# EAGLE design ottawa-badge-mini-r1-staff (EAGLE 5.12)
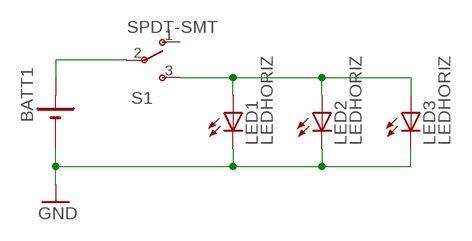
[diagram p0: schematic, sheet 1]

## Parts
BATT1  2032SMD  [2032SMD]
LED1  LEDHORIZ  [5MMLED-HORIZ]
LED2  LEDHORIZ  [5MMLED-HORIZ]
LED3  LEDHORIZ  [5MMLED-HORIZ]
S1  SPDT-SMT  [SPDT-SMT]

## Nets
GND: BATT1.- LED1.K(C) LED2.K(C) LED3.K(C)
N$1: BATT1.+ S1.2(P)
N$2: LED1.A LED2.A LED3.A S1.3(S)
Unconnected: S1.1(O)

## Library data of the parts
BATT1 = rbg-4ucon-battery:2032SMD
LED1-LED3 = artwork:LED
S1 = smt-spdt-aliexpress:SPDT-SMT

## Board
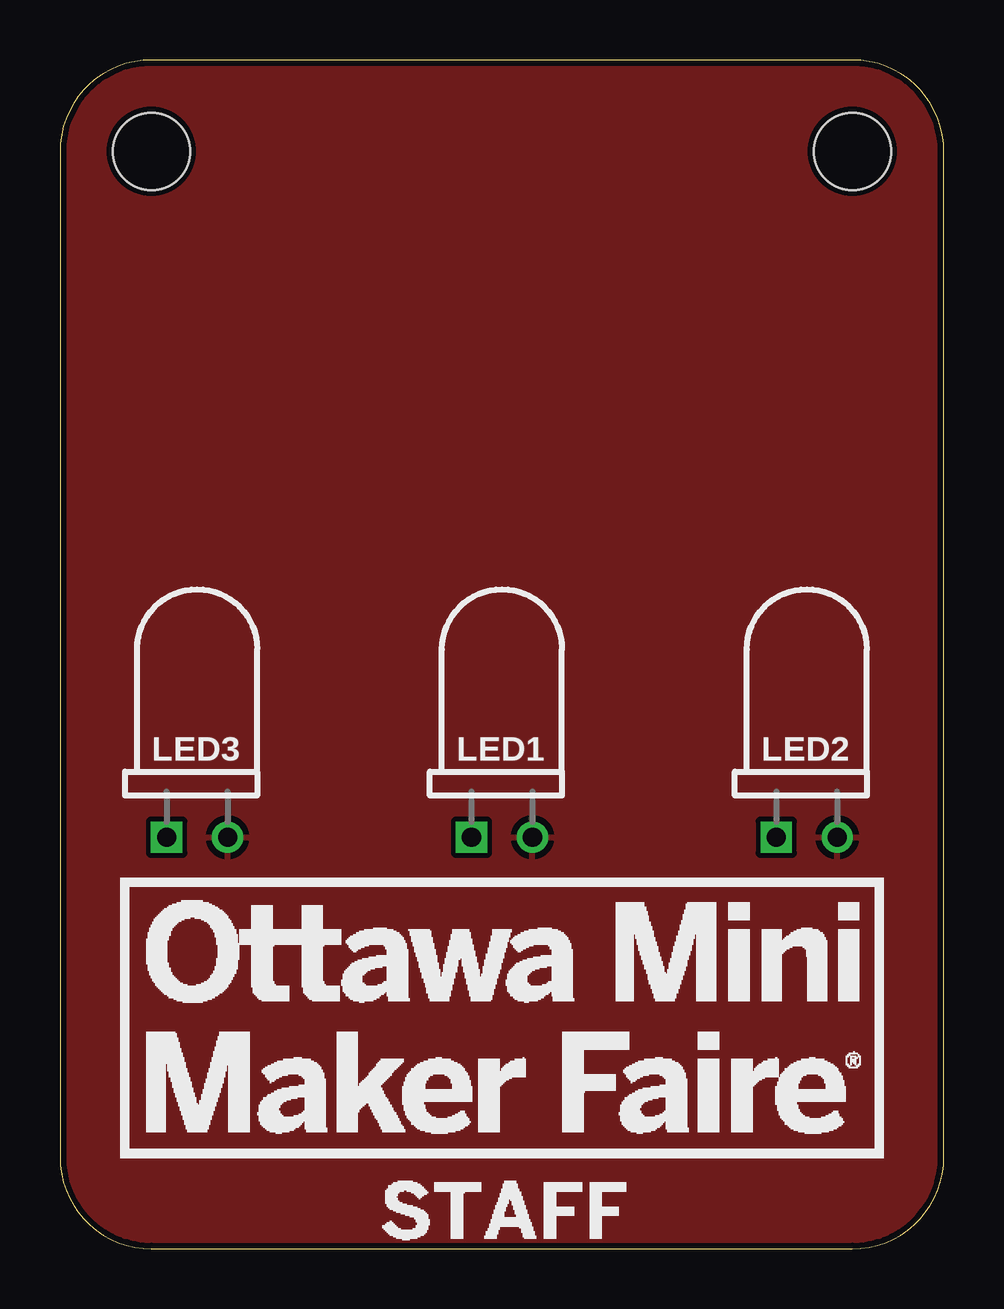
[diagram p1: board, top side]
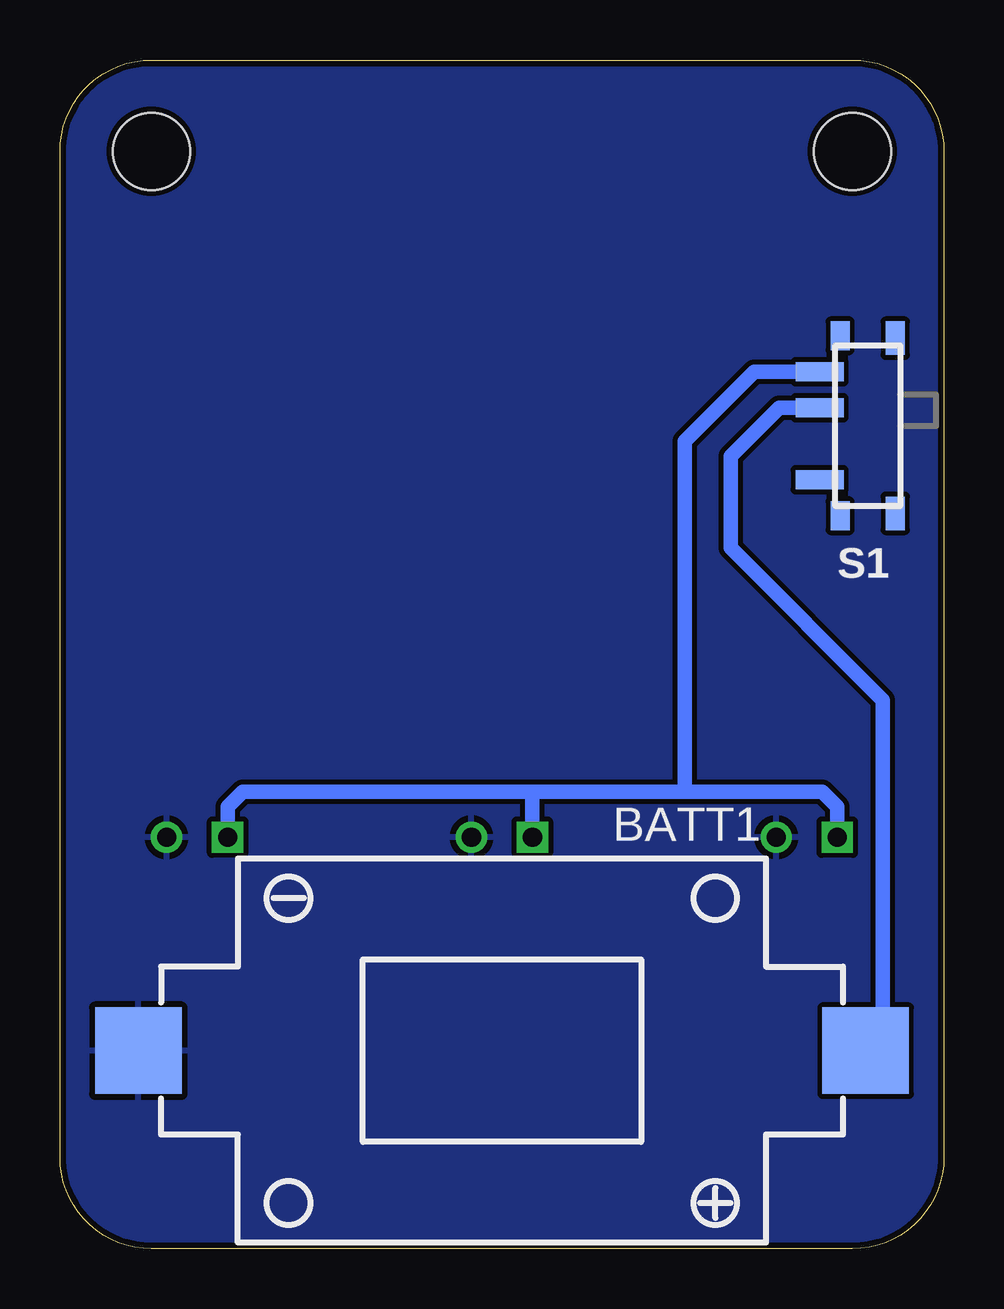
[diagram p2: board, bottom side, seen from below]

Size 36.83 x 49.53 mm. Coordinates in mm from the lower left corner, seen from the top.
Outline: 33.02,0 arc90 36.83,3.81 36.83,45.72 arc90 33.02,49.53 3.81,49.53 arc90 0,45.72 0,3.81 arc90 3.81,0 33.02,0
Copper layers (1*16): Top 0.035mm / dielectric 1.5mm / Bottom 0.035mm
Design rules "default *": minimum track width 10mil, minimum drill 0.6mm, track to track 8mil, track to pad 8mil, pad to pad 8mil, via to via 8mil, smd to smd 8mil, copper to edge 10mil, drill to drill 8mil, minimum pad ring 10mil, minimum via ring 8mil, stop-mask expansion 4mil, vias tented up to drill 0mil, thermal gap 10mil
Holes 3.2 mm at 3.81,45.72 33.02,45.72

### Footprints (pad centres in the part's own frame; a part is rotated, then mirrored left to right if it is on the bottom)
2032SMD = smd 3.6 x 3.6: + -15.15,0; - 15.15,0
5MMLED-HORIZ = drill 0.8 square: A -1.27,0 | drill 0.8 round: K 1.27,0
SPDT-SMT = smd 2 x 0.8: 1 -2,-2.25; 2 -2,0.75; 3 -2,2.25 | smd 0.8 x 1.2: A -1.15,3.75; D -1.15,-3.75 | smd 0.8 x 1.4: B 1.15,3.65; C 1.15,-3.65

### Placement (x,y rotation side)
BATT1  18.41,8.26 180 bottom
LED1  18.41,17.14 0 top
LED2  31.11,17.14 0 top
LED3  5.71,17.14 0 top
S1  3.17,34.29 0 bottom
U$1  [PEACETOWER-400]  1.91,27.3 0 top
U$2  [LOGO-400]  2.54,3.81 0 top
U$3  [STAFF-400]  2.54,0 0 top

### Tracks (layer width: path | path; a pad name or v marks a point on that pad's centre or on a via)
GND
  pour Top: -1.27,50.8 37.47,50.8 37.47,-1.27 -1.27,-1.27
  pour Bottom: -1.27,50.8 37.47,50.8 37.47,-1.27 -1.27,-1.27
N$1
  Bottom 0.61: S1.2 6.87,35.04 8.89,33.02 8.89,29.21 2.54,22.86 2.54,8.98 BATT1.+
N$2
  Bottom 0.61: LED3.A 4.45,18.41 5.08,19.05 10.79,19.05 | LED2.A 29.84,18.41 29.21,19.05 17.14,19.05 | 10.79,19.05 17.14,19.05 | 17.14,19.05 LED1.A | S1.3 7.91,36.54 10.79,33.66 10.79,19.05